# Altium schematic sheet Power.SchDoc
size A
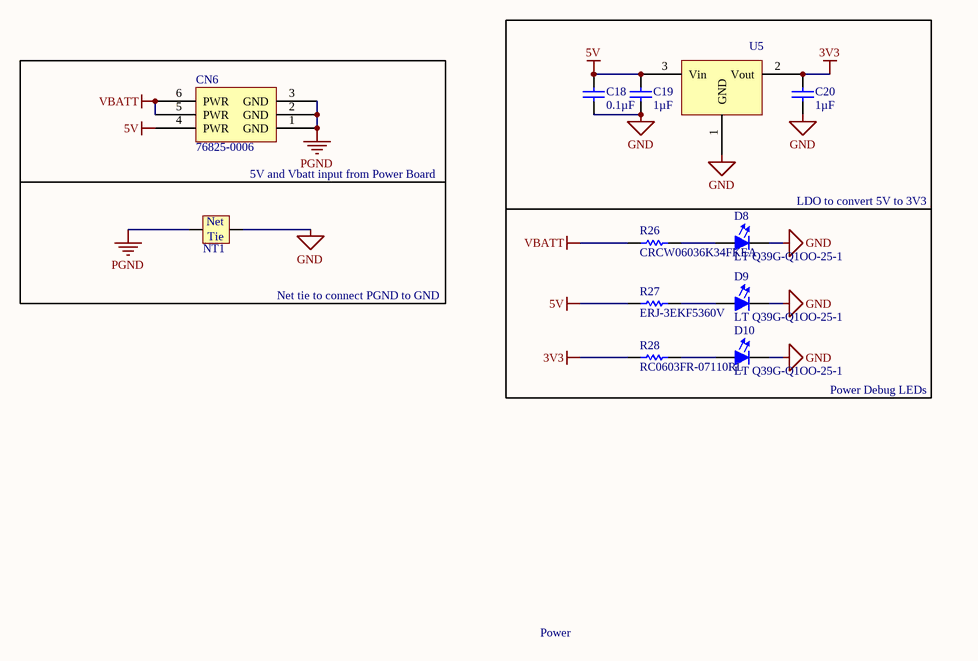
[diagram p0: Power.SchDoc]

## Parts
C18  Capacitance: 0.1µF  [CAPC1608N(0603")]  (hidden comment: 0.1uF, 50V, 10%, X7R, 1608)
C19  value 1µF  [CAPC1608N(0603")]  (hidden comment: 1uF 50V 0603 SMD, Ceramic)
C20  value 1µF  [CAPC1608N(0603")]  (hidden comment: 1uF 50V 0603 SMD, Ceramic)
CN6  76825-0006  [76825-0006-Footprint-1]
D8  LT Q39G-Q1OO-25-1  [FP-LB_Q39E-MFG]
D9  LT Q39G-Q1OO-25-1  [FP-LB_Q39E-MFG]
D10  LT Q39G-Q1OO-25-1  [FP-LB_Q39E-MFG]
NT1  Net Tie, 20mil  [NETTIE_20mil]  (value not drawn)  (net tie, no BOM)
R26  CRCW06036K34FKEA  [RESC1609X50X30ML10T20]
R27  ERJ-3EKF5360V  [RESC1608X55X30ML15T15]
R28  RC0603FR-07110RL  [RESC1608X55X25ML10T15]
U5  3.3V 250mA Linear Reg LDO  [SOT95P245X110-3N]  (value not drawn)

## Blocks framed on the sheet
5V and Vbatt input from Power Board: CN6
Net tie to connect PGND to GND: NT1

## Nets
3V3: C20.2(Cathode) R28.1 U5.2(Vout)
5V: C18.2(Cathode) C19.2(Cathode) CN6.4(PWR) R27.1 U5.3(Vin)
GND: C18.1(Anode) C19.1(Anode) C20.1(Anode) D8.1(Cathode) D9.1(Cathode) D10.1(Cathode) NT1.2 U5.1(GND)
PGND: CN6.1(GND) CN6.2(GND) CN6.3(GND) NT1.1
VBATT: CN6.5(PWR) CN6.6(PWR) R26.1
NetD8_2: D8.2(Anode) R26.2
NetD9_2: D9.2(Anode) R27.2
NetD10_2: D10.2(Anode) R28.2

## Notes on the sheet
- LDO to convert 5V to 3V3
- Power Debug LEDs
- Power
- Title
- Size:
- Date:
- A
- Number:
- Time:
- Revision:
- Sheet
- of
- File:
- (in symbol CMP-053-0006-1) Net; Tie

## Library data of the parts
C18 = CMP-006-0008-1: CAP CER 0.1UF 50V 10% X7R 1608 (0603); Manufacturer: Samsung Electro-Mechanics America, Inc; Manufacturer Part Number: CL10B104KB8SFNC; Size / Dimension: 0.063" L x 0.031" W (1.60mm x 0.80mm); Design Item ID: 0.1uF, 50V, 10%, X7R, 1608; RoHS: RoHS Compliant; Package / Case: 0603 (1608 Metric); Packaging: Cut Tape (CT); Height - Seated (Max): -; Component Type: Standard; Source: AUVic_Schematic_Library_Capacitors.SchLib; ComponentLink1URL: http://www.samsungsem.com/servlet/FileDownload?type=spec&file=CL10B104KB8SFNC.pdf; Tolerance: ±10%; Operating Temperature: -55°C ~ 125°C; Mounting Type: Surface Mount, MLCC; Features: Soft Termination; Lead Style: -; Pin Count: 2; Temperature Coefficient: X7R; Applications: Boardflex Sensitive; Voltage - Rated: 50V; Ratings: -; ComponentLink1Description: http://www.samsungsem.com/servlet/FileDownload?type=spec&file=CL10B104KB8SFNC.pdf; Thickness (Max): 0.035" (0.90mm); Stock 1: 743572; Category: Capacitors; Lead Spacing: -; Pricing 1: 1=0.12, 10=0.033, 25=0.0232, 100=0.0152, 500=0.01064, 1000=0.00829 (CAD)
C19 C20 = CMP-006-0028-1: Capacitor, Ceramic, 50V, +/- 10%, 0603 SMD, X5R; Design Item ID: 1uF 50V 0603 SMD, Ceramic; Created By: Lyden Smith; PackageDescription: Chip Capacitor; Source: AUVic_Schematic_Library_Capacitors.SchLib; Date Created: 2017-10-26; Pin Count: 2; Component Type: Standard
CN6 = CMP-00049-2: CONNECTOR, HEADER, 6POS, 2ROW, 5.7MM; Product Range:Mega-Fit 76825 Series; Contact Termination Type:Through Hole; Gender:Header; No. of Contacts:6; Pitch Spacing:5.7mm; Contact Plating:Tin Plated Contacts; Contact Material:Copper; Gender: Male; Number of Circuits: 6; REACH SVHC: Unknown; Termination: Through Hole; Orientation: Right Angle; Number of Rows: 2; Color: Black; Contact Plating: Tin; Contact Material: Copper; Number of Contacts: 6; Pitch: 5.7mm; Number of Pins: 6; Mount: Through Hole
D8-D10 = CMP-00064-3: LED GREEN DIFFUSED 0603 SMD; Dominant Wavelength: 530nm; Luminous Intensity: 280mcd; Lens Style: Diffused,Colorless,Rectangular; Number of LEDs: 1; Forward Voltage: 2.85V; Test Current: 5mA; Reverse Voltage: 5V; Forward Current: 15mA; Luminous Flux: 0.55lm; Radiation Hardening: No; Packaging: Tape and Reel; Mount: Surface Mount; Color: Green; Max Operating Temperature: 85°C; Number of Elements: 1; Number of Pins: 2; Min Operating Temperature: -40°C; Depth: 0.9mm; Case/Package: SMD/SMT; Length: 1.7mm
NT1 = CMP-053-0006-1: Net Tie, 20mil by 20mil; Size: 0.254mm x 0.508mm; Design Item ID: Net Tie, 20mil; Publisher: AUVic; Pin Count: 2; Source: AUVic_Integrated_Library_Virtual_Components.SchLib; Created By: Ashwin Sira; Date Created: 2016-06-17; Component Type: Net Tie
R26 = CMP-00072-1: VISHAY         CRCW06036K34FKEA.             SMD Chip Resistor, Thick Film, 6.34 kohm, 75 V, 0603 [1608 Metric], 100 mW,  1%, CRCW Series; Resistance: 6.34kR; Temperature Coefficient: 100ppm/°C; Voltage Rating: 75V; Power Rating: 100mW; Depth: 0.85mm; Military Standard: Not; Case Code (Imperial): 0603; Composition: Thick Film; Packaging: Tape and Reel; Width: 0.033inch; Termination: SMD/SMT; Length: 1.55mm; Case/Package: 0603; Height: 0.45mm; Contact Plating: Tin; Features: Automotive AEC-Q200; Case Code (Metric): 1608; Min Operating Temperature: -55°C; Package Quantity: 10; REACH SVHC: Unknown; Radiation Hardening: No; Max Operating Temperature: 155°C; Tolerance: 1%; Number of Terminations: 2; Weight: 7.1E-05oz; Max Power Dissipation: 100mW; Number of Pins: 2
R27 = CMP-00071-1: SMD Chip Resistor, 0603 [1608 Metric], 536 ohm, ERJ3EK Series, 75 V, Thick Film, 100 mW; Tolerance: 1%; Voltage Rating (DC): 50V; Voltage Rating: 75V; Resistance: 536R; Power Rating: 100mW; Temperature Coefficient: 100ppm/°C; Max Operating Temperature: 155°C; Package Quantity: 1; REACH SVHC: No SVHC; Depth: 0.8mm; Composition: Thick Film; Height: 0.022inch; Packaging: Tape and Reel; Contact Plating: Tin; Lead Free: Lead Free; Length: 1.6mm; Case/Package: 0603; Military Standard: Not; Features: Automotive AEC-Q200; Termination: SMD/SMT; Max Power Dissipation: 100mW; Width: 0.8mm; Mount: Surface Mount; Case Code (Metric): 1608; Case Code (Imperial): 0603; Number of Terminations: 2; Min Operating Temperature: -55°C
R28 = CMP-00069-1: RES SMD 110 OHM 1% 1/10W 0603; Max Power Dissipation: 100mW; Voltage Rating (DC): 50V; Resistance: 110R; Temperature Coefficient: 100ppm/°C; Working Voltage: 75V; Military Standard: Not; Termination: SMD/SMT; Number of Terminations: 2; Features: Moisture Resistant; Min Operating Temperature: -55°C; Power Rating: 100mW; Height: 0.022inch; Package Quantity: 1; Lead Free: Lead Free; Tolerance: 1%; Voltage Rating: 50V; Composition: Thick Film; Case Code (Imperial): 0603; Length: 1.6mm; Packaging: Tape and Reel; Case Code (Metric): 1608; Max Operating Temperature: 155°C; Depth: 0.8mm; Case/Package: 0603; Width: 0.031inch
U5 = CMP-00003-1: IC REG LINEAR 3.3V 250MA SOT23-3; Max Input Voltage: 6.6V; Accuracy: 2%; Polarity: Positive; Number of Outputs: 1; Output Type: Fixed; Dropout Voltage: 400mV; Quiescent Current: 1uA; Min Input Voltage: 2.5V; Min Operating Temperature: -40°C; Supplier 1: Digi-Key; Supplier Part Number 1: AP2138N-3.3TRG1; Width: 1.7mm; Length: 3.02mm; Height: 1.3mm; Output Current: 250mA; Created By: Poorna Chander Kalidas; Number of Regulators: 1; Number of Pins: 3; Package Quantity: 3000; Date Created: June 26, 2020; Output Voltage: 3.3V; Max Operating Temperature: 85°C; Max Output Current: 250mA; Weight: 0.000282oz; Packaging: Tape and Reel; Lead Free: Lead Free; Mount: Surface Mount; Case/Package: SOT-23-3